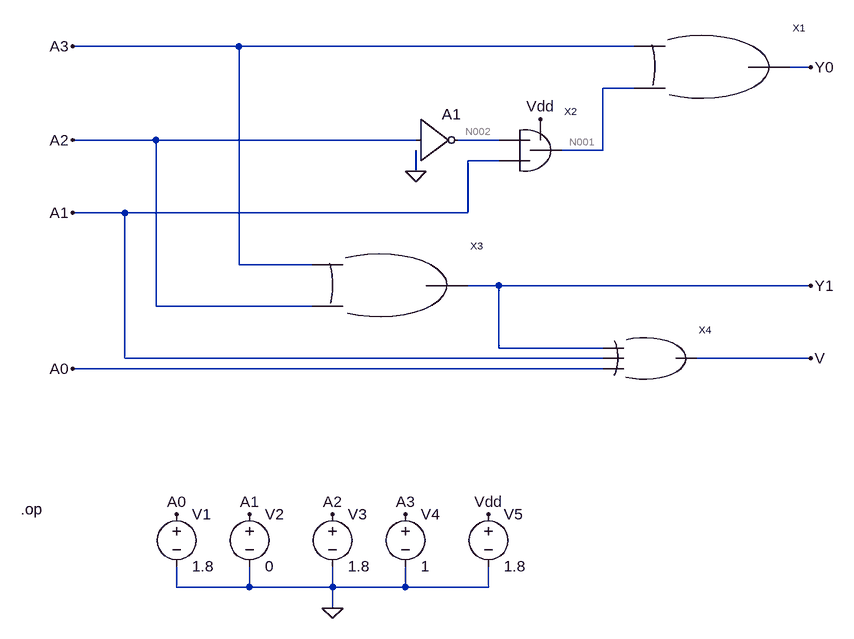
[diagram p0: schematic Draft4.asc]
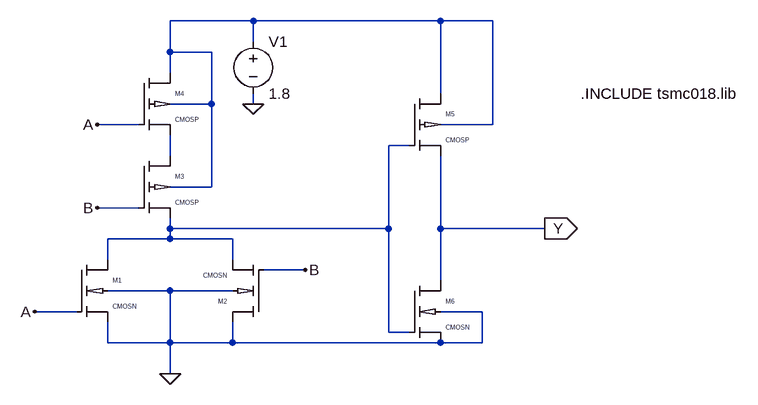
[diagram p1: sub-circuit or.asc]
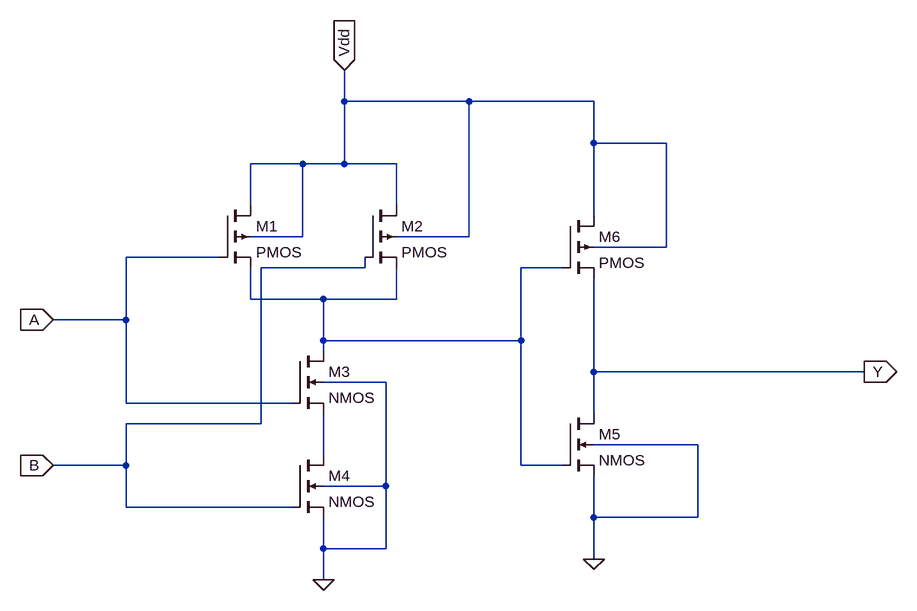
[diagram p2: sub-circuit and.asc]
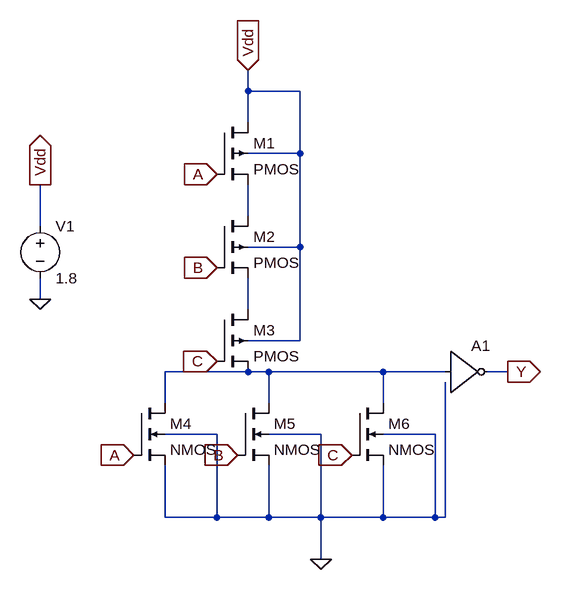
[diagram p3: sub-circuit or3.asc]
Draft4.asc, the LTspice schematic file:
Version 4
SHEET 1 880 884
WIRE -176 0 -432 0
WIRE 432 0 -176 0
WIRE 704 32 672 32
WIRE 432 64 384 64
WIRE -304 144 -432 144
WIRE 96 144 -304 144
WIRE 224 144 160 144
WIRE 384 160 384 64
WIRE 384 160 320 160
WIRE 224 176 176 176
WIRE 96 192 96 160
WIRE -352 256 -432 256
WIRE 176 256 176 176
WIRE 176 256 -352 256
WIRE -176 336 -176 0
WIRE -64 336 -176 336
WIRE 224 368 176 368
WIRE 704 368 224 368
WIRE -304 400 -304 144
WIRE -64 400 -304 400
WIRE 224 464 224 368
WIRE 384 464 224 464
WIRE -352 480 -352 256
WIRE 384 480 -352 480
WIRE 704 480 528 480
WIRE 384 496 -432 496
WIRE -272 832 -272 800
WIRE -160 832 -160 800
WIRE -160 832 -272 832
WIRE -32 832 -32 800
WIRE -32 832 -160 832
WIRE 80 832 80 800
WIRE 80 832 -32 832
WIRE 208 832 208 800
WIRE 208 832 80 832
WIRE -32 864 -32 832
FLAG 96 192 0
FLAG 288 112 Vdd
FLAG 704 32 Y0
FLAG 704 368 Y1
FLAG 704 480 V
FLAG -432 0 A3
FLAG -432 144 A2
FLAG -432 256 A1
FLAG -432 496 A0
FLAG -32 864 0
FLAG 80 720 A3
FLAG -32 720 A2
FLAG -160 720 A1
FLAG -272 720 A0
FLAG 208 720 Vdd
SYMBOL Digital\\inv 96 80 R0
SYMATTR InstName A1
SYMBOL OR 544 32 R0
SYMATTR InstName X1
SYMBOL AND 256 176 R0
SYMATTR InstName X2
SYMBOL OR 48 368 R0
SYMATTR InstName X3
SYMBOL OR3 432 480 R0
SYMATTR InstName X4
SYMBOL voltage -272 704 R0
WINDOW 123 0 0 Left 0
WINDOW 39 0 0 Left 0
SYMATTR InstName V1
SYMATTR Value 1.8
SYMBOL voltage -160 704 R0
WINDOW 123 0 0 Left 0
WINDOW 39 0 0 Left 0
SYMATTR InstName V2
SYMATTR Value 0
SYMBOL voltage -32 704 R0
WINDOW 123 0 0 Left 0
WINDOW 39 0 0 Left 0
SYMATTR InstName V3
SYMATTR Value 1.8
SYMBOL voltage 80 704 R0
WINDOW 123 0 0 Left 0
WINDOW 39 0 0 Left 0
SYMATTR InstName V4
SYMATTR Value 1
SYMBOL voltage 208 704 R0
WINDOW 123 0 0 Left 0
WINDOW 39 0 0 Left 0
SYMATTR InstName V5
SYMATTR Value 1.8
TEXT -512 712 Left 2 !.op

or.asc, the sub-circuit schematic file:
Version 4
SHEET 1 1052 680
WIRE 288 -208 160 -208
WIRE 576 -208 288 -208
WIRE 656 -208 576 -208
WIRE 288 -176 288 -208
WIRE 160 -160 160 -208
WIRE 224 -160 160 -160
WIRE 160 -128 160 -160
WIRE 576 -96 576 -208
WIRE 224 -80 224 -160
WIRE 224 -80 160 -80
WIRE 288 -80 288 -96
WIRE 112 -48 48 -48
WIRE 656 -48 656 -208
WIRE 656 -48 576 -48
WIRE 528 -16 496 -16
WIRE 160 0 160 -32
WIRE 224 48 224 -80
WIRE 224 48 160 48
WIRE 112 80 48 80
WIRE 160 112 160 96
WIRE 496 112 496 -16
WIRE 496 112 160 112
WIRE 576 112 576 0
WIRE 736 112 576 112
WIRE 160 128 160 112
WIRE 160 128 64 128
WIRE 256 128 160 128
WIRE 64 160 64 128
WIRE 256 160 256 128
WIRE 368 176 304 176
WIRE 576 192 576 112
WIRE 160 208 64 208
WIRE 256 208 160 208
WIRE 16 240 -48 240
WIRE 640 240 576 240
WIRE 496 272 496 112
WIRE 528 272 496 272
WIRE 64 288 64 256
WIRE 160 288 160 208
WIRE 160 288 64 288
WIRE 256 288 256 256
WIRE 256 288 160 288
WIRE 576 288 256 288
WIRE 640 288 640 240
WIRE 640 288 576 288
WIRE 160 336 160 288
FLAG 160 336 0
FLAG 288 -80 0
FLAG 48 -48 A
FLAG -48 240 A
FLAG 48 80 B
FLAG 368 176 B
FLAG 736 112 Y
IOPIN 736 112 Out
SYMBOL Ncmos 16 160 R0
SYMATTR InstName M1
SYMATTR Value2 l=180n w=360n
SYMBOL Ncmos 304 256 R180
SYMATTR InstName M2
SYMATTR Value2 l=180n w=360n
SYMBOL Pcmos 112 0 R0
SYMATTR InstName M3
SYMATTR Value2 l=180n w=360n
SYMBOL Pcmos 112 -128 R0
SYMATTR InstName M4
SYMATTR Value2 l=180n w=360n
SYMBOL voltage 288 -192 R0
WINDOW 123 0 0 Left 0
WINDOW 39 0 0 Left 0
SYMATTR InstName V1
SYMATTR Value 1.8
SYMBOL Pcmos 528 -96 R0
SYMATTR InstName M5
SYMATTR Value2 l=180n w=360n
SYMBOL Ncmos 528 192 R0
SYMATTR InstName M6
SYMATTR Value2 l=180n w=360n
TEXT 792 -96 Left 2 !.INCLUDE tsmc018.lib

and.asc, the sub-circuit schematic file:
Version 4
SHEET 1 1100 680
WIRE 224 -112 224 -160
WIRE 416 -112 224 -112
WIRE 608 -112 416 -112
WIRE 608 -48 608 -112
WIRE 720 -48 608 -48
WIRE 160 -16 80 -16
WIRE 224 -16 224 -112
WIRE 224 -16 160 -16
WIRE 304 -16 224 -16
WIRE 80 48 80 -16
WIRE 304 48 304 -16
WIRE 608 64 608 -48
WIRE 160 96 160 -16
WIRE 160 96 80 96
WIRE 416 96 416 -112
WIRE 416 96 304 96
WIRE 720 112 720 -48
WIRE 720 112 608 112
WIRE 32 128 -112 128
WIRE 256 144 256 128
WIRE 256 144 96 144
WIRE 560 144 496 144
WIRE 80 192 80 144
WIRE 192 192 80 192
WIRE 304 192 304 144
WIRE 304 192 192 192
WIRE -112 224 -112 128
WIRE -112 224 -224 224
WIRE 192 256 192 192
WIRE 496 256 496 144
WIRE 496 256 192 256
WIRE 192 272 192 256
WIRE 608 304 608 160
WIRE 1024 304 608 304
WIRE 288 320 192 320
WIRE -112 352 -112 224
WIRE 144 352 -112 352
WIRE 608 368 608 304
WIRE 96 384 96 144
WIRE 96 384 -112 384
WIRE 768 416 608 416
WIRE 192 432 192 368
WIRE -112 448 -112 384
WIRE -112 448 -224 448
WIRE 496 448 496 256
WIRE 560 448 496 448
WIRE 288 480 288 320
WIRE 288 480 192 480
WIRE -112 512 -112 448
WIRE 144 512 -112 512
WIRE 608 528 608 464
WIRE 768 528 768 416
WIRE 768 528 608 528
WIRE 192 576 192 528
WIRE 288 576 288 480
WIRE 288 576 192 576
WIRE 608 592 608 528
WIRE 192 624 192 576
FLAG 192 624 0
FLAG -224 224 A
IOPIN -224 224 In
FLAG -224 448 B
IOPIN -224 448 In
FLAG 224 -160 Vdd
IOPIN 224 -160 In
FLAG 608 592 0
FLAG 1024 304 Y
IOPIN 1024 304 Out
SYMBOL pmos4 32 48 R0
SYMATTR InstName M1
SYMBOL nmos4 144 272 R0
SYMATTR InstName M3
SYMBOL nmos4 144 432 R0
SYMATTR InstName M4
SYMBOL nmos4 560 368 R0
SYMATTR InstName M5
SYMBOL pmos4 560 64 R0
SYMATTR InstName M6
SYMBOL pmos4 256 48 R0
SYMATTR InstName M2

or3.asc, the sub-circuit schematic file:
Version 4
SHEET 1 880 692
WIRE 112 -48 112 -80
WIRE 192 -48 112 -48
WIRE 112 0 112 -48
WIRE 192 48 192 -48
WIRE 192 48 112 48
WIRE 112 144 112 96
WIRE -208 160 -208 96
WIRE 192 192 192 48
WIRE 192 192 112 192
WIRE -208 272 -208 240
WIRE 112 288 112 240
WIRE 192 336 192 192
WIRE 192 336 112 336
WIRE 112 384 -16 384
WIRE 144 384 112 384
WIRE 320 384 144 384
WIRE 416 384 320 384
WIRE 512 384 480 384
WIRE -16 432 -16 384
WIRE 144 432 144 384
WIRE 320 432 320 384
WIRE 64 480 -16 480
WIRE 224 480 144 480
WIRE 400 480 320 480
WIRE -16 608 -16 528
WIRE 64 608 64 480
WIRE 64 608 -16 608
WIRE 144 608 144 528
WIRE 144 608 64 608
WIRE 224 608 224 480
WIRE 224 608 144 608
WIRE 320 608 320 528
WIRE 320 608 224 608
WIRE 400 608 400 480
WIRE 400 608 320 608
WIRE 416 608 416 400
WIRE 416 608 400 608
WIRE 224 672 224 608
FLAG 64 80 A
IOPIN 64 80 In
FLAG -64 512 A
IOPIN -64 512 In
FLAG 64 224 B
IOPIN 64 224 In
FLAG 96 512 B
IOPIN 96 512 In
FLAG 64 368 C
IOPIN 64 368 In
FLAG 272 512 C
IOPIN 272 512 In
FLAG 224 672 0
FLAG 512 384 Y
IOPIN 512 384 Out
FLAG -208 272 0
FLAG -208 96 Vdd
IOPIN -208 96 Out
FLAG 112 -80 Vdd
IOPIN 112 -80 In
SYMBOL pmos4 64 0 R0
SYMATTR InstName M1
SYMBOL pmos4 64 144 R0
SYMATTR InstName M2
SYMATTR Value2 l=180n
SYMBOL pmos4 64 288 R0
SYMATTR InstName M3
SYMATTR Value2 l=180n
SYMBOL nmos4 -64 432 R0
SYMATTR InstName M4
SYMATTR Value2 l=180n
SYMBOL nmos4 96 432 R0
SYMATTR InstName M5
SYMATTR Value2 l=180n
SYMBOL nmos4 272 432 R0
SYMATTR InstName M6
SYMATTR Value2 l=180n
SYMBOL voltage -208 144 R0
WINDOW 123 0 0 Left 0
WINDOW 39 0 0 Left 0
SYMATTR InstName V1
SYMATTR Value 1.8
SYMBOL Digital\\inv 416 320 R0
SYMATTR InstName A1

The netlist it stands for:
* Draft4.asc
A1 A2 0 0 0 0 N002 0 0 BUF
XX1 A3 N001 Y0 or
XX2 N002 A1 Vdd N001 and
XX3 A3 A2 Y1 or
XX4 V Y1 A1 A0 or3
V1 A0 0 1.8
V2 A1 0 0
V3 A2 0 1.8
V4 A3 0 1
V5 Vdd 0 1.8

* block symbol definitions
.subckt or A B Y
M1 N002 A 0 0 CMOSN l=180n w=360n
M2 0 B N002 0 CMOSN l=180n w=360n
M3 N003 B N002 N001 CMOSP l=180n w=360n
M4 N001 A N003 N001 CMOSP l=180n w=360n
V1 N001 0 1.8
M5 N001 N002 Y N001 CMOSP l=180n w=360n
M6 Y N002 0 0 CMOSN l=180n w=360n
.INCLUDE tsmc018.lib
.ends or

.subckt and A B Vdd Y
M1 Vdd A N001 Vdd PMOS
M3 N001 A N002 0 NMOS
M4 N002 B 0 0 NMOS
M5 Y N001 0 0 NMOS
M6 Vdd N001 Y Vdd PMOS
M2 Vdd B N001 Vdd PMOS
.ends and

.subckt or3 Y A B C
M1 Vdd A N001 Vdd PMOS
M2 N001 B N002 Vdd PMOS l=180n
M3 N002 C N003 Vdd PMOS l=180n
M4 N003 A 0 0 NMOS l=180n
M5 N003 B 0 0 NMOS l=180n
M6 N003 C 0 0 NMOS l=180n
V1 Vdd 0 1.8
A1 N003 0 0 0 0 Y 0 0 BUF
.ends or3

.model NMOS NMOS
.model PMOS PMOS
.lib standard.mos
.op
.lib tsmc018.lib
.backanno
.end

* Results of the author's LTspice run, read from the files saved beside the schematic
* Operating Point:
*   V(a2) = 1.8 V
*   V(n002) = 0 V
*   V(a3) = 1 V
*   V(n001) = 100.3 nV
*   V(y0) = 1.8 V
*   V(vdd) = 1.8 V
*   V(a1) = 0 V
*   V(y1) = 1.8 V
*   V(a0) = 1.8 V
*   V(v) = 1 V
*   I(V5) = -6.775 pA
*   I(V4) = 0 A
*   I(V3) = 0 A
*   I(V2) = 0 A
*   I(V1) = 0 A
*   I8(A1) = 0 A
*   I6(A1) = 0 A
*   Ix(x1:A) = 0 A
*   Ix(x1:B) = 0 A
*   Ix(x1:Y) = 0 A
*   Ix(x2:A) = 0 A
*   Ix(x2:B) = 0 A
*   Ix(x2:VDD) = 6.775 pA
*   Ix(x2:Y) = 0 A
*   Ix(x3:A) = 0 A
*   Ix(x3:B) = 0 A
*   Ix(x3:Y) = 0 A
*   Ix(x4:Y) = 0 A
*   Ix(x4:A) = 0 A
*   Ix(x4:B) = 0 A
*   Ix(x4:C) = 0 A
* From the log:
*   Semiconductor Device Operating Points:
*                           --- MOSFET Transistors ---
*   Name:        m:x4:6      m:x4:5      m:x4:4      m:x2:5      m:x2:4
*   Model:        nmos        nmos        nmos        nmos        nmos
*   Id:          1.66e-12    1.98e-22    1.66e-12    3.61e-12    9.00e-13
*   Vgs:         1.80e+00    0.00e+00    1.80e+00    1.80e+00    0.00e+00
*   Vds:         8.29e-11    8.29e-11    8.29e-11    1.00e-07    4.45e-01
*   Vbs:         0.00e+00    0.00e+00    0.00e+00    0.00e+00    0.00e+00
*   Vth:         0.00e+00    0.00e+00    0.00e+00    0.00e+00    0.00e+00
*   Vdsat:       1.80e+00    0.00e+00    1.80e+00    1.80e+00    0.00e+00
*   Gm:          9.21e-13    0.00e+00    9.21e-13    2.01e-12    0.00e+00
*   Gds:         2.00e-02    0.00e+00    2.00e-02    3.60e-05    0.00e+00
*   Gmb:         0.00e+00    0.00e+00    0.00e+00    0.00e+00    0.00e+00
*   Cbd:         0.00e+00    0.00e+00    0.00e+00    0.00e+00    0.00e+00
*   Cbs:         0.00e+00    0.00e+00    0.00e+00    0.00e+00    0.00e+00
*   Cgsov:       0.00e+00    0.00e+00    0.00e+00    0.00e+00    0.00e+00
*   Cgdov:       0.00e+00    0.00e+00    0.00e+00    0.00e+00    0.00e+00
*   Cgbov:       0.00e+00    0.00e+00    0.00e+00    0.00e+00    0.00e+00
*   Cgs:         0.00e+00    0.00e+00    0.00e+00    0.00e+00    0.00e+00
*   Cgd:         0.00e+00    0.00e+00    0.00e+00    0.00e+00    0.00e+00
*   Cgb:         0.00e+00   -0.00e+00    0.00e+00    0.00e+00   -0.00e+00
*   Name:        m:x2:3      m:x4:3      m:x4:2      m:x4:1      m:x2:2
*   Model:        nmos        pmos        pmos        pmos        pmos
*   Id:          3.16e-12    1.20e-12    5.97e-13    2.93e-13    1.58e-12
*   Vgs:        -4.45e-01    1.80e+00   -1.51e+00    2.93e-01   -1.80e+00
*   Vds:         1.35e+00    1.51e+00    5.38e-11    2.93e-01    4.40e-08
*   Vbs:        -4.45e-01    1.80e+00    2.93e-01    2.93e-01    4.40e-08
*   Vth:         0.00e+00   -0.00e+00   -0.00e+00   -0.00e+00   -0.00e+00
*   Vdsat:       0.00e+00   -0.00e+00   -1.51e+00   -1.08e-07   -1.80e+00
*   Gm:          0.00e+00    0.00e+00    5.97e-13    2.17e-12    8.79e-13
*   Gds:         0.00e+00    0.00e+00    1.67e-02    0.00e+00    3.60e-05
*   Gmb:         0.00e+00    0.00e+00    0.00e+00    0.00e+00    0.00e+00
*   Cbd:         0.00e+00    0.00e+00    0.00e+00    0.00e+00    0.00e+00
*   Cbs:         0.00e+00    0.00e+00    0.00e+00    0.00e+00    0.00e+00
*   Cgsov:       0.00e+00    0.00e+00    0.00e+00    0.00e+00    0.00e+00
*   Cgdov:       0.00e+00    0.00e+00    0.00e+00    0.00e+00    0.00e+00
*   Cgbov:       0.00e+00    0.00e+00    0.00e+00    0.00e+00    0.00e+00
*   Cgs:         0.00e+00    0.00e+00    0.00e+00    0.00e+00    0.00e+00
*   Cgd:         0.00e+00    0.00e+00    0.00e+00    0.00e+00    0.00e+00
*   Cgb:         0.00e+00    0.00e+00    0.00e+00    0.00e+00    0.00e+00
*   Name:        m:x2:6      m:x2:1
*   Model:        pmos        pmos
*   Id:          1.80e-12    1.58e-12
*   Vgs:         1.80e+00   -1.80e+00
*   Vds:         1.80e+00    4.40e-08
*   Vbs:         1.80e+00    4.40e-08
*   Vth:        -0.00e+00   -0.00e+00
*   Vdsat:      -4.40e-08   -1.80e+00
*   Gm:          8.79e-13    8.79e-13
*   Gds:         0.00e+00    3.60e-05
*   Gmb:         0.00e+00    0.00e+00
*   Cbd:         0.00e+00    0.00e+00
*   Cbs:         0.00e+00    0.00e+00
*   Cgsov:       0.00e+00    0.00e+00
*   Cgdov:       0.00e+00    0.00e+00
*   Cgbov:       0.00e+00    0.00e+00
*   Cgs:         0.00e+00    0.00e+00
*   Cgd:         0.00e+00    0.00e+00
*   Cgb:         0.00e+00    0.00e+00
*                           --- BSIM3 MOSFETS ---
*   Name:      m:x3:5      m:x3:4      m:x3:3      m:x3:6      m:x3:2
*   Model:    x3:cmosp    x3:cmosp    x3:cmosp    x3:cmosn    x3:cmosn
*   Id:        2.07e-11    4.02e-12    4.02e-12    2.07e-11   -3.63e-12
*   Vgs:      -1.80e+00   -8.00e-01    1.80e+00    5.09e-09    1.80e+00
*   Vds:       1.08e-07    6.64e-08    1.80e+00    1.80e+00   -5.09e-09
*   Vbs:       1.08e-07    6.64e-08    1.80e+00    0.00e+00   -5.09e-09
*   Vth:      -4.58e-01   -4.58e-01   -4.49e-01    4.40e-01    4.61e-01
*   Vdsat:    -8.80e-01   -2.52e-01   -3.80e-02    3.65e-02    4.10e-01
*   Gm:        9.00e-12    1.19e-11    1.03e-10    5.17e-10    7.05e-13
*   Gds:       1.91e-04    6.06e-05    1.01e-12    1.23e-11    7.14e-04
*   Gmb        2.70e-12    3.97e-12    3.98e-11    1.78e-10    4.79e-13
*   Cbd:       0.00e+00    0.00e+00    0.00e+00    0.00e+00    0.00e+00
*   Cbs:       0.00e+00    0.00e+00    0.00e+00    0.00e+00    0.00e+00
*   Cgsov:     2.29e-16    2.29e-16    2.29e-16    2.96e-16    2.96e-16
*   Cgdov:     2.29e-16    2.29e-16    2.29e-16    2.96e-16    2.96e-16
*   Cgbov:     1.21e-19    1.21e-19    1.21e-19    1.46e-19    1.46e-19
*   dQgdVgb:   8.25e-16    8.26e-16    5.59e-16    7.26e-16    1.04e-15
*   dQgdVdb:  -4.04e-16   -3.87e-16   -2.29e-16   -2.96e-16   -5.06e-16
*   dQgdVsb:  -4.34e-16   -4.51e-16   -2.29e-16   -2.96e-16   -5.25e-16
*   dQddVgb:  -4.12e-16   -4.12e-16   -2.29e-16   -2.96e-16   -5.18e-16
*   dQddVdb:   4.47e-16    4.27e-16    2.29e-16    2.96e-16    5.45e-16
*   dQddVsb:   2.55e-17    4.62e-17    1.65e-21    1.17e-21    3.98e-17
*   dQbdVgb:  -8.21e-19   -1.84e-18   -1.02e-16   -1.33e-16   -9.72e-19
*   dQbdVdb:  -2.62e-16   -2.37e-16    1.13e-24    2.81e-24   -2.88e-16
*   dQbdVsb:   1.54e-16    1.30e-16    3.09e-21    4.11e-21    1.49e-16
*   Name:      m:x3:1      m:x1:5      m:x1:4      m:x1:3      m:x1:6
*   Model:    x3:cmosn    x1:cmosp    x1:cmosp    x1:cmosp    x1:cmosn
*   Id:        2.20e-12    4.11e-11    1.10e-05    1.10e-05    4.11e-11
*   Vgs:       1.00e+00   -1.77e+00   -1.57e-02   -2.67e-02    2.67e-02
*   Vds:       5.09e-09    2.18e-07    7.84e-01    9.89e-01    1.80e+00
*   Vbs:       0.00e+00    2.18e-07    7.84e-01    1.77e+00    0.00e+00
*   Vth:       4.61e-01   -4.58e-01   -4.54e-01   -6.82e-01    4.40e-01
*   Vdsat:     2.28e-01   -8.62e-01   -2.54e-01   -2.65e-01    3.65e-02
*   Gm:        3.18e-12    1.86e-11    5.69e-05    5.80e-05    1.08e-09
*   Gds:       4.32e-04    1.89e-04    1.98e-06    1.55e-06    2.55e-11
*   Gmb        9.87e-13    5.64e-12    1.75e-05    1.53e-05    3.65e-10
*   Cbd:       0.00e+00    0.00e+00    0.00e+00    0.00e+00    0.00e+00
*   Cbs:       0.00e+00    0.00e+00    0.00e+00    0.00e+00    0.00e+00
*   Cgsov:     2.96e-16    2.29e-16    2.29e-16    2.29e-16    2.96e-16
*   Cgdov:     2.96e-16    2.29e-16    2.29e-16    2.29e-16    2.96e-16
*   Cgbov:     1.46e-19    1.21e-19    1.21e-19    1.21e-19    1.46e-19
*   dQgdVgb:   1.04e-15    8.25e-16    7.77e-16    7.72e-16    7.24e-16
*   dQgdVdb:  -4.96e-16   -4.04e-16   -2.27e-16   -2.27e-16   -2.96e-16
*   dQgdVsb:  -5.35e-16   -4.34e-16   -5.48e-16   -5.49e-16   -2.96e-16
*   dQddVgb:  -5.18e-16   -4.12e-16   -3.51e-16   -3.51e-16   -2.96e-16
*   dQddVdb:   5.33e-16    4.47e-16    2.28e-16    2.28e-16    2.96e-16
*   dQddVsb:   5.19e-17    2.56e-17    1.63e-16    1.55e-16    2.44e-21
*   dQbdVgb:  -1.77e-18   -8.35e-19   -7.48e-17   -7.01e-17   -1.31e-16
*   dQbdVdb:  -2.74e-16   -2.62e-16   -8.83e-20   -9.64e-20    5.64e-24
*   dQbdVsb:   1.35e-16    1.54e-16   -7.84e-18    9.86e-18    3.71e-21
*   Name:      m:x1:2      m:x1:1
*   Model:    x1:cmosn    x1:cmosn
*   Id:       -2.80e-12    1.10e-05
*   Vgs:      -2.67e-02    1.00e+00
*   Vds:      -2.67e-02    2.67e-02
*   Vbs:      -2.67e-02    0.00e+00
*   Vth:       4.60e-01    4.60e-01
*   Vdsat:     3.65e-02    2.28e-01
*   Gm:        7.67e-11    1.67e-05
*   Gds:       6.02e-11    3.94e-04
*   Gmb        2.70e-11    5.09e-06
*   Cbd:       0.00e+00    0.00e+00
*   Cbs:       0.00e+00    0.00e+00
*   Cgsov:     2.96e-16    2.96e-16
*   Cgdov:     2.96e-16    2.96e-16
*   Cgbov:     1.46e-19    1.46e-19
*   dQgdVgb:   7.26e-16    1.04e-15
*   dQgdVdb:  -2.96e-16   -4.85e-16
*   dQgdVsb:  -2.96e-16   -5.46e-16
*   dQddVgb:  -2.96e-16   -5.17e-16
*   dQddVdb:   2.96e-16    5.19e-16
*   dQddVsb:   6.70e-22    6.23e-17
*   dQbdVgb:  -1.33e-16   -3.31e-18
*   dQbdVdb:  -9.09e-23   -2.58e-16
*   dQbdVsb:   4.24e-21    1.25e-16